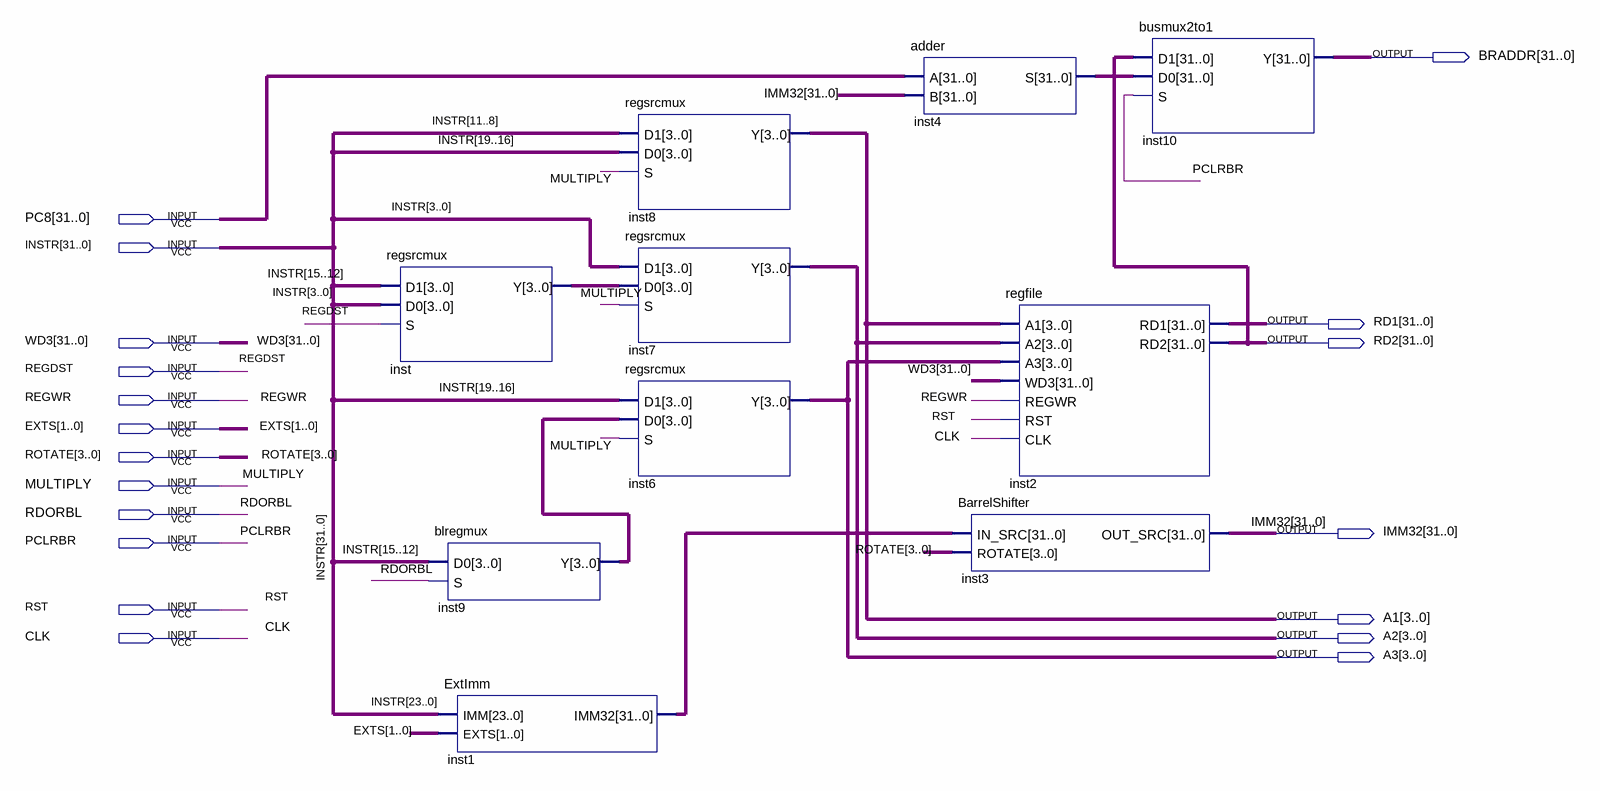
[diagram p0: schematic sheet]
// Quartus schematic decode.bdf as structural Verilog: 10 symbols, 19 pins
module decode (
  input  [31:0] PC8,
  input  [31:0] INSTR,
  input  [31:0] WD3,
  input  REGDST,
  input  REGWR,
  input  [1:0] EXTS,
  input  [3:0] ROTATE,
  input  MULTIPLY,
  input  RDORBL,
  input  PCLRBR,
  input  RST,
  input  CLK,
  output [31:0] BRADDR,
  output [31:0] RD1,
  output [31:0] RD2,
  output [31:0] IMM32,
  output [3:0] A1,
  output [3:0] A2,
  output [3:0] A3
);

  wire [3:0] inst9_y, inst_y;
  wire [31:0] inst1_imm32, inst4_s;

  regsrcmux inst (.D1(INSTR[15:12]), .D0(INSTR[3:0]), .S(REGDST), .Y(inst_y));
  blregmux inst9 (.D0(INSTR[15:12]), .S(RDORBL), .Y(inst9_y));
  ExtImm inst1 (.IMM(INSTR[23:0]), .EXTS(EXTS), .IMM32(inst1_imm32));
  regsrcmux inst8 (.D1(INSTR[11:8]), .D0(INSTR[19:16]), .S(MULTIPLY), .Y(A1));
  regsrcmux inst7 (.D1(INSTR[3:0]), .D0(inst_y), .S(MULTIPLY), .Y(A2));
  regsrcmux inst6 (.D1(INSTR[19:16]), .D0(inst9_y), .S(MULTIPLY), .Y(A3));
  adder inst4 (.A(PC8), .B(IMM32), .S(inst4_s));
  BarrelShifter inst3 (.IN_SRC(inst1_imm32), .ROTATE(ROTATE), .OUT_SRC(IMM32));
  regfile inst2 (.A1(A1), .A2(A2), .A3(A3), .WD3(WD3), .REGWR(REGWR), .RST(RST), .CLK(CLK), .RD1(RD1), .RD2(RD2));
  busmux2to1 inst10 (.D1(RD2), .D0(inst4_s), .S(PCLRBR), .Y(BRADDR));
endmodule
